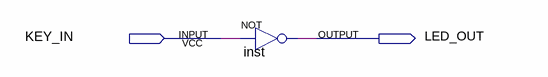
[diagram p0: schematic sheet]
// Quartus schematic LED_KEY.bdf as structural Verilog: 1 symbols, 2 pins
module LED_KEY (
  input  KEY_IN,
  output LED_OUT
);

  not inst (LED_OUT, KEY_IN);
endmodule
